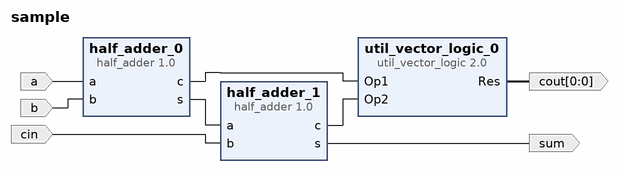
[diagram p0: block diagram of the top level]
# Vivado block design sample, xc7a100tcsg324-1, Vivado 2024.2
create_bd_design sample

create_bd_port -dir I a
create_bd_port -dir I b
create_bd_port -dir O sum
create_bd_port -dir O -from 0 -to 0 cout
create_bd_port -dir I cin

create_bd_cell -type ip -vlnv xilinx.com:user:half_adder:1.0 half_adder_0
create_bd_cell -type ip -vlnv xilinx.com:user:half_adder:1.0 half_adder_1
create_bd_cell -type ip -vlnv xilinx.com:ip:util_vector_logic:2.0 util_vector_logic_0
set_property -dict {CONFIG.C_OPERATION or CONFIG.C_SIZE 1} [get_bd_cells util_vector_logic_0]

# ---- connections ----

connect_bd_net -net a_0_1 [get_bd_ports a] [get_bd_pins half_adder_0/a]
connect_bd_net -net b_0_1 [get_bd_ports b] [get_bd_pins half_adder_0/b]
connect_bd_net -net b_0_2 [get_bd_ports cin] [get_bd_pins half_adder_1/b]
connect_bd_net [get_bd_pins half_adder_0/c] [get_bd_pins util_vector_logic_0/Op1]
connect_bd_net [get_bd_pins half_adder_0/s] [get_bd_pins half_adder_1/a]
connect_bd_net [get_bd_pins half_adder_1/c] [get_bd_pins util_vector_logic_0/Op2]
connect_bd_net [get_bd_pins half_adder_1/s] [get_bd_ports sum]
connect_bd_net [get_bd_pins util_vector_logic_0/Res] [get_bd_ports cout]

validate_bd_design
save_bd_design
